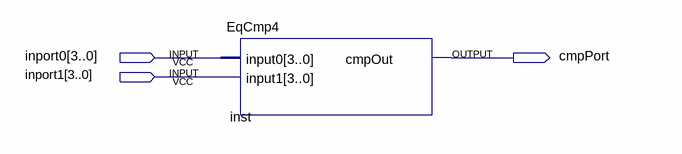
[diagram p0: schematic sheet]
// Quartus schematic EqCmpDemo.bdf as structural Verilog: 1 symbols, 3 pins
module EqCmpDemo (
  input  [3:0] inport0,
  input  [3:0] inport1,
  output cmpPort
);

  EqCmp4 inst (.input0(inport0), .input1(inport1), .cmpOut(cmpPort));
endmodule
